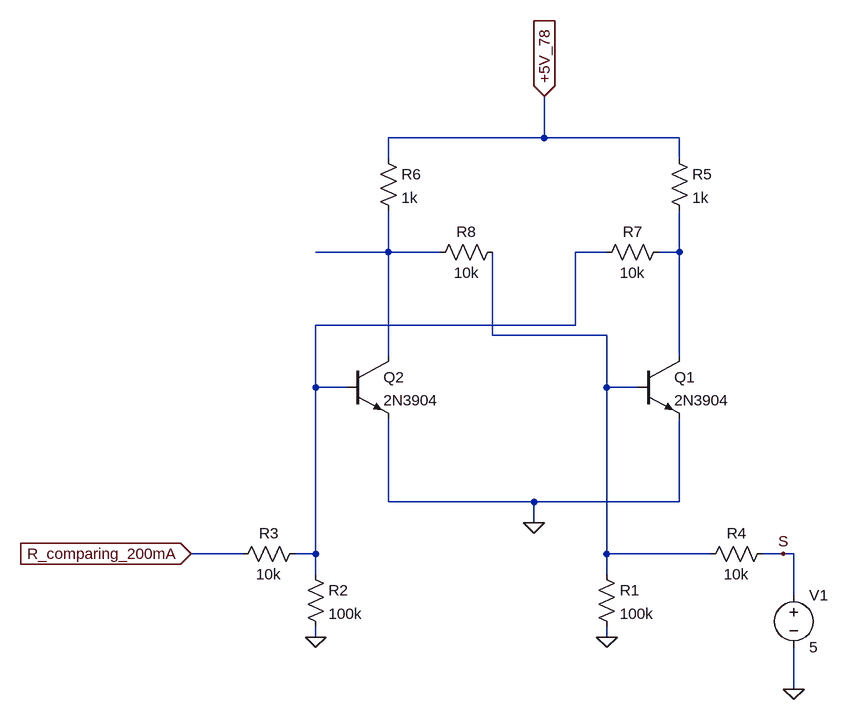
[diagram p0: schematic Latch.asc]
Latch.asc, the LTspice schematic file:
Version 4
SHEET 1 880 756
WIRE 272 -112 272 -176
WIRE 272 -112 32 -112
WIRE 480 -112 272 -112
WIRE 32 -80 32 -112
WIRE 480 -80 480 -112
WIRE 32 64 32 0
WIRE 32 64 -80 64
WIRE 112 64 32 64
WIRE 368 64 320 64
WIRE 480 64 480 0
WIRE 480 64 448 64
WIRE 320 176 320 64
WIRE 320 176 -80 176
WIRE 192 192 192 64
WIRE 368 192 192 192
WIRE 32 224 32 64
WIRE 480 224 480 64
WIRE -80 272 -80 176
WIRE -32 272 -80 272
WIRE 368 272 368 192
WIRE 416 272 368 272
WIRE 32 448 32 320
WIRE 256 448 32 448
WIRE 480 448 480 320
WIRE 480 448 256 448
WIRE 256 480 256 448
WIRE -192 528 -272 528
WIRE -80 528 -80 272
WIRE -80 528 -112 528
WIRE 368 528 368 272
WIRE 528 528 368 528
WIRE 640 528 608 528
WIRE 656 528 640 528
WIRE -80 560 -80 528
WIRE 368 560 368 528
WIRE 656 592 656 528
WIRE -80 656 -80 640
WIRE 368 656 368 640
WIRE 656 736 656 672
FLAG 256 480 0
FLAG -80 656 0
FLAG 368 656 0
FLAG 272 -176 +5V_78
IOPIN 272 -176 In
FLAG 656 736 0
FLAG -272 528 R_comparing_200mA
IOPIN -272 528 In
FLAG 640 528 S
SYMBOL npn 416 224 R0
SYMATTR InstName Q1
SYMATTR Value 2N3904
SYMBOL npn -32 224 R0
SYMATTR InstName Q2
SYMATTR Value 2N3904
SYMBOL res 352 544 R0
SYMATTR InstName R1
SYMATTR Value 100k
SYMBOL res -96 544 R0
SYMATTR InstName R2
SYMATTR Value 100k
SYMBOL res -96 512 R90
WINDOW 0 0 56 VBottom 2
WINDOW 3 32 56 VTop 2
SYMATTR InstName R3
SYMATTR Value 10k
SYMBOL res 624 512 R90
WINDOW 0 0 56 VBottom 2
WINDOW 3 32 56 VTop 2
SYMATTR InstName R4
SYMATTR Value 10k
SYMBOL res 464 -96 R0
SYMATTR InstName R5
SYMATTR Value 1k
SYMBOL res 16 -96 R0
SYMATTR InstName R6
SYMATTR Value 1k
SYMBOL res 464 48 R90
WINDOW 0 0 56 VBottom 2
WINDOW 3 32 56 VTop 2
SYMATTR InstName R7
SYMATTR Value 10k
SYMBOL res 208 48 R90
WINDOW 0 0 56 VBottom 2
WINDOW 3 32 56 VTop 2
SYMATTR InstName R8
SYMATTR Value 10k
SYMBOL voltage 656 576 R0
WINDOW 123 0 0 Left 0
WINDOW 39 0 0 Left 0
SYMATTR InstName V1
SYMATTR Value 5

The netlist it stands for:
* Latch.asc
Q1 N003 N004 0 0 2N3904
Q2 N001 N002 0 0 2N3904
R1 N004 0 100k
R2 N002 0 100k
R3 N002 R_comparing_200mA 10k
R4 S N004 10k
R5 +5V_78 N003 1k
R6 +5V_78 N001 1k
R7 N003 N002 10k
R8 N004 N001 10k
V1 S 0 5
.model NPN NPN
.model PNP PNP
.lib standard.bjt
.backanno
.end